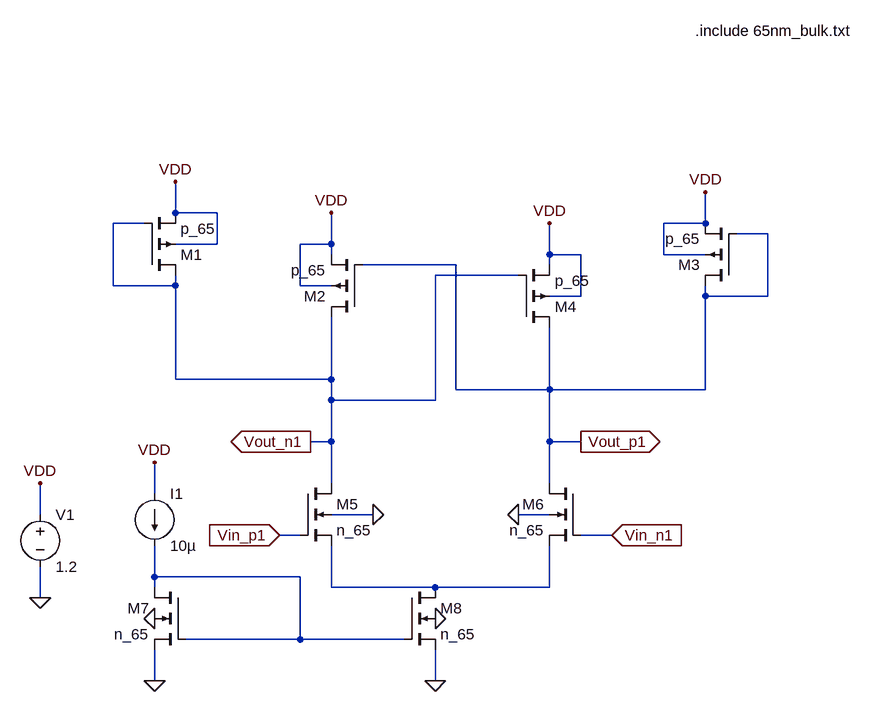
[diagram p0: schematic pre_amp.asc]
pre_amp.asc, the LTspice schematic file:
Version 4
SHEET 1 1700 864
WIRE 304 128 304 80
WIRE 368 128 304 128
WIRE 256 144 208 144
WIRE 1120 144 1120 96
WIRE 1120 144 1056 144
WIRE 1216 160 1168 160
WIRE 368 176 368 128
WIRE 368 176 304 176
WIRE 544 176 544 128
WIRE 544 176 496 176
WIRE 544 192 544 176
WIRE 880 192 880 144
WIRE 928 192 880 192
WIRE 1056 192 1056 144
WIRE 1120 192 1056 192
WIRE 736 208 592 208
WIRE 880 208 880 192
WIRE 832 224 704 224
WIRE 208 240 208 144
WIRE 304 240 304 224
WIRE 304 240 208 240
WIRE 496 240 496 176
WIRE 544 240 496 240
WIRE 928 256 928 192
WIRE 928 256 880 256
WIRE 1120 256 1120 240
WIRE 1216 256 1216 160
WIRE 1216 256 1120 256
WIRE 304 384 304 240
WIRE 544 384 544 288
WIRE 544 384 304 384
WIRE 736 400 736 208
WIRE 880 400 880 304
WIRE 880 400 736 400
WIRE 1120 400 1120 256
WIRE 1120 400 880 400
WIRE 544 416 544 384
WIRE 704 416 704 224
WIRE 704 416 544 416
WIRE 544 480 544 416
WIRE 544 480 512 480
WIRE 880 480 880 400
WIRE 928 480 880 480
WIRE 544 544 544 480
WIRE 880 544 880 480
WIRE 272 560 272 512
WIRE 96 592 96 544
WIRE 608 592 544 592
WIRE 880 592 832 592
WIRE 496 624 464 624
WIRE 976 624 928 624
WIRE 272 688 272 640
WIRE 496 688 272 688
WIRE 272 704 272 688
WIRE 544 704 544 640
WIRE 704 704 544 704
WIRE 880 704 880 640
WIRE 880 704 704 704
WIRE 96 720 96 672
WIRE 496 784 496 688
WIRE 496 784 320 784
WIRE 656 784 496 784
WIRE 272 848 272 800
WIRE 704 848 704 800
FLAG 304 80 VDD
FLAG 544 128 VDD
FLAG 880 144 VDD
FLAG 1120 96 VDD
FLAG 272 848 0
FLAG 704 848 0
FLAG 96 720 0
FLAG 608 592 0
FLAG 832 592 0
FLAG 704 752 0
FLAG 272 752 0
FLAG 272 512 VDD
FLAG 96 544 VDD
FLAG 976 624 Vin_n1
IOPIN 976 624 In
FLAG 464 624 Vin_p1
IOPIN 464 624 In
FLAG 512 480 Vout_n1
IOPIN 512 480 Out
FLAG 928 480 Vout_p1
IOPIN 928 480 Out
SYMBOL pmos4 256 224 M180
SYMATTR InstName M1
SYMATTR Value p_65
SYMATTR Value2 l=200n w=10u
SYMBOL pmos4 592 288 R180
SYMATTR InstName M2
SYMATTR Value p_65
SYMATTR Value2 l=200n w=9u
SYMBOL pmos4 1168 240 R180
SYMATTR InstName M3
SYMATTR Value p_65
SYMATTR Value2 l=200n w=10u
SYMBOL pmos4 832 304 M180
SYMATTR InstName M4
SYMATTR Value p_65
SYMATTR Value2 l=200n w=9u
SYMBOL nmos4 496 544 R0
SYMATTR InstName M5
SYMATTR Value n_65
SYMATTR Value2 l=100n w=10u
SYMBOL nmos4 928 544 M0
SYMATTR InstName M6
SYMATTR Value n_65
SYMATTR Value2 l=100n w=10u
SYMBOL nmos4 320 704 M0
SYMATTR InstName M7
SYMATTR Value n_65
SYMATTR Value2 l=300n w=10u
SYMBOL nmos4 656 704 R0
SYMATTR InstName M8
SYMATTR Value n_65
SYMATTR Value2 l=300n w=10u
SYMBOL current 272 560 R0
SYMATTR InstName I1
SYMATTR Value 10µ
SYMBOL Voltage 96 576 R0
SYMATTR InstName V1
SYMATTR Value 1.2
TEXT 1104 -152 Left 2 !.include 65nm_bulk.txt

The netlist it stands for:
* pre_amp.asc
M1 Vout_n1 Vout_n1 VDD VDD p_65 l=200n w=10u
M2 Vout_n1 Vout_p1 VDD VDD p_65 l=200n w=9u
M3 Vout_p1 Vout_p1 VDD VDD p_65 l=200n w=10u
M4 Vout_p1 Vout_n1 VDD VDD p_65 l=200n w=9u
M5 Vout_n1 Vin_p1 N002 0 n_65 l=100n w=10u
M6 Vout_p1 Vin_n1 N002 0 n_65 l=100n w=10u
M7 N001 N001 0 0 n_65 l=300n w=10u
M8 N002 N001 0 0 n_65 l=300n w=10u
I1 VDD N001 10µ
V1 VDD 0 1.2
.model NMOS NMOS
.model PMOS PMOS
.lib standard.mos
.include 65nm_bulk.txt
.backanno
.end